# EAGLE design RPi_board_0.0.1 (EAGLE 7.2.0)
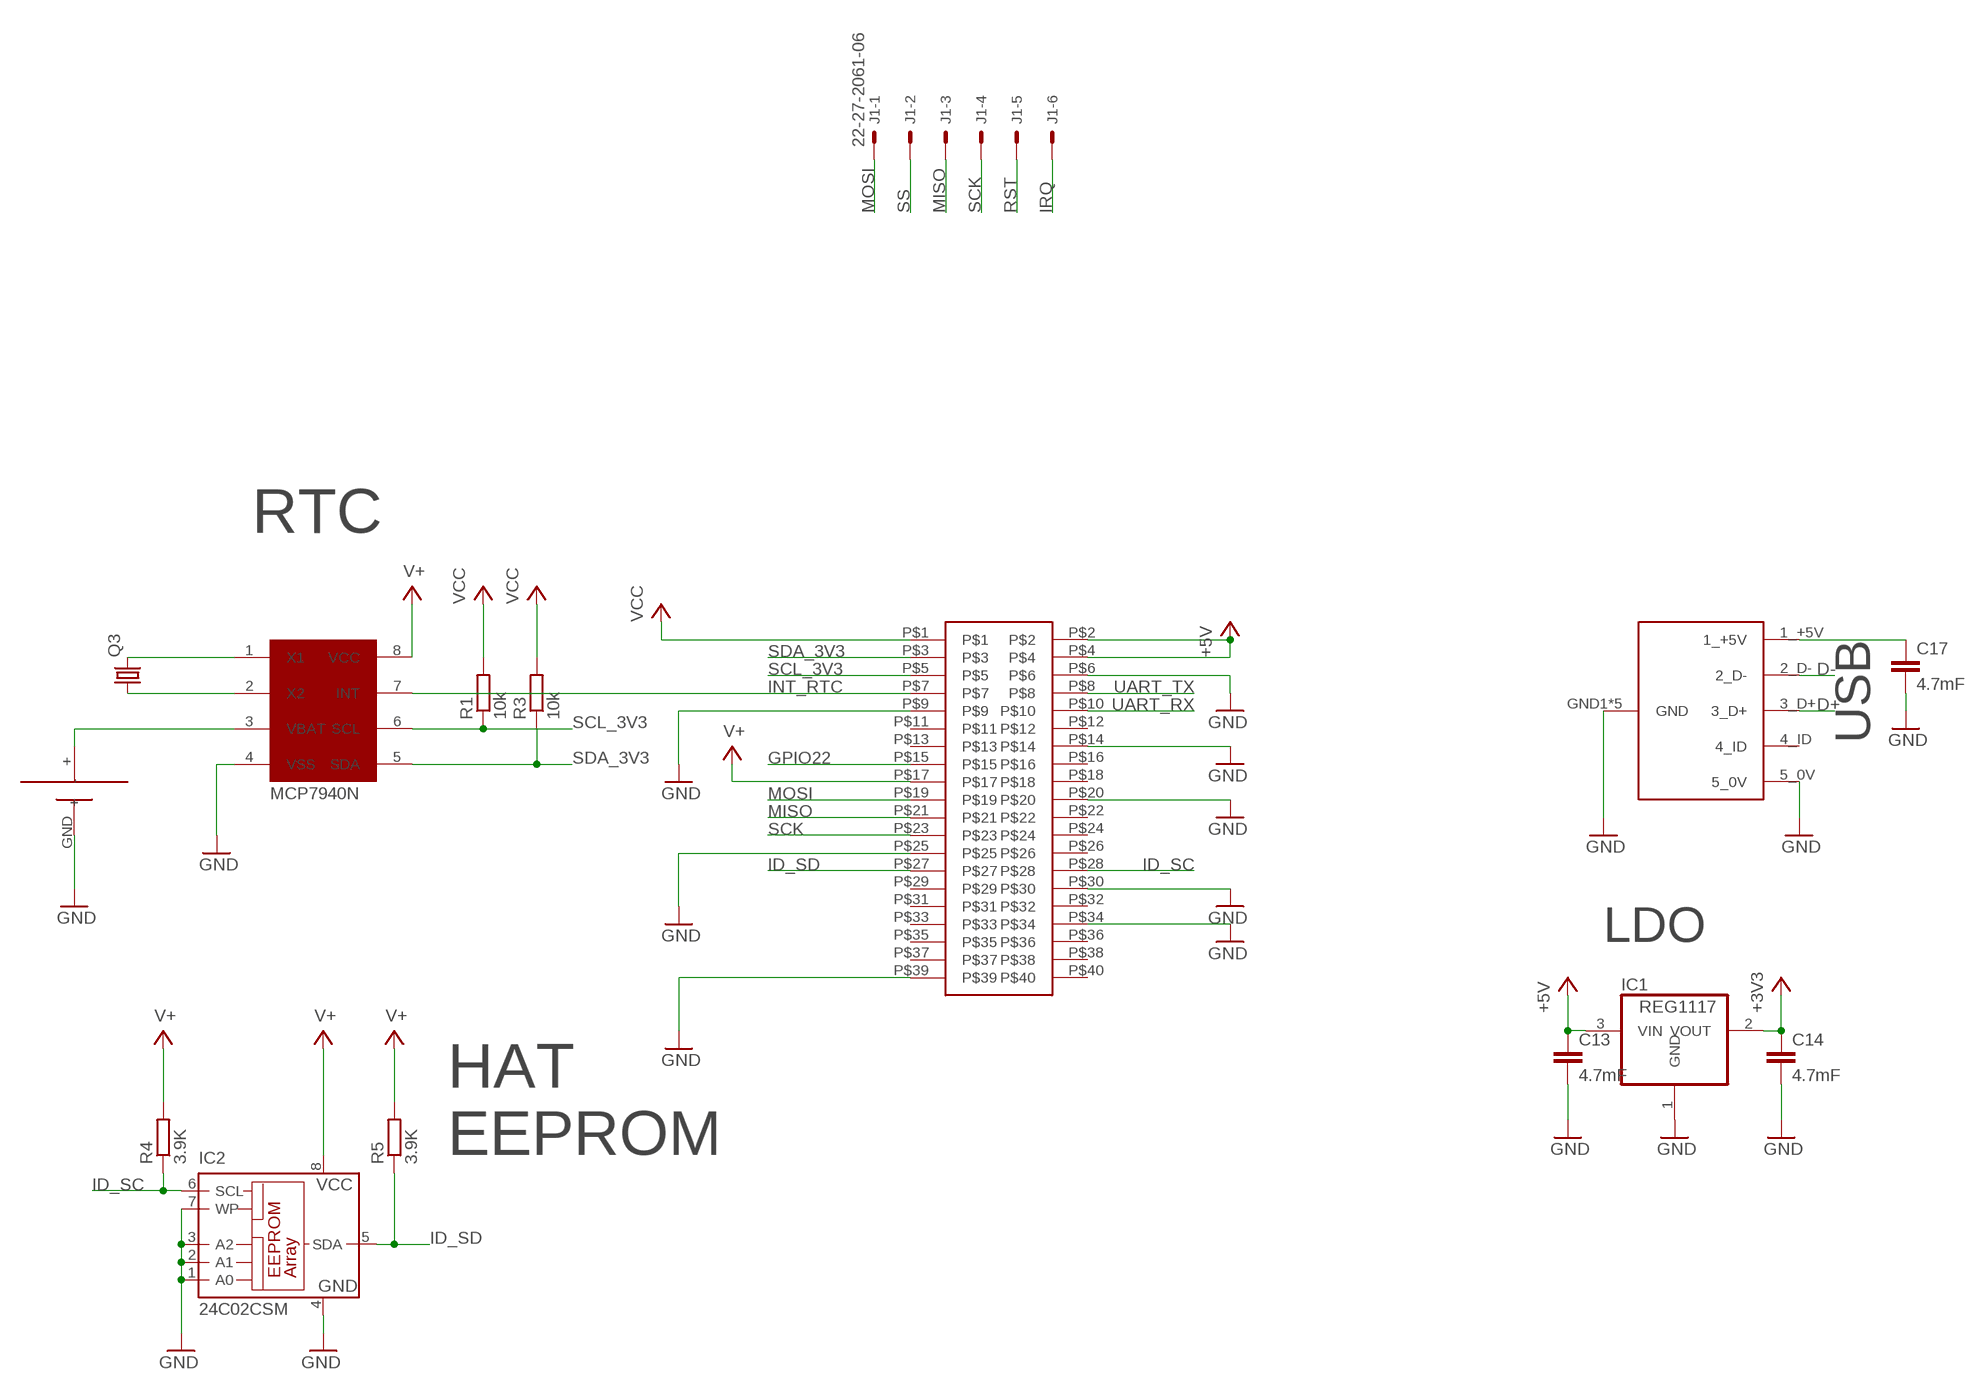
[diagram p0: schematic, sheet 1]

## Parts
C13  4.7mF  C-EUC0603  [C0603]
C14  4.7mF  C-EUC0603  [C0603]
C17  4.7mF  C-EUC0603  [C0603]
IC1  REG1117  [SOT223]
IC2  24C02CSM  [SO-08M]
J1  22-27-2061-06  [6410-06]
Q3  CRYSTALMM20SS  [MM20SS]
R1  10k  R-EU_R0603  [R0603]
R3  10k  R-EU_R0603  [R0603]
R4  3.9K  R-EU_R0603  [R0603]
R5  3.9K  R-EU_R0603  [R0603]
U$4  CR1216  [CR1216]
U$5  MCP7940N  [SO08]
U$9  MICRO_USB  [MICRO_USB]
U$11  HEADER  [20X2]

## Nets
+3V3: C14.1 IC1.2(VOUT)
+5V: C13.1 IC1.3(VIN) U$11.P$2 U$11.P$4
D+: U$9.3_D+
D-: U$9.2_D-
GND: C13.2 C14.2 C17.2 IC1.1(GND) IC2.1(A0) IC2.2(A1) IC2.3(A2) IC2.4(GND) IC2.7(WP) U$4.GND(-) U$5.4(VSS) U$9.5_0V U$9.GND1(GND) U$9.GND2(GND) U$9.GND5(GND) U$9.P$1(GND) U$9.P$7(GND) U$11.P$6 U$11.P$9 U$11.P$14 U$11.P$20 U$11.P$25 U$11.P$30 U$11.P$34 U$11.P$39
GPIO22: U$11.P$15
ID_SC: IC2.6(SCL) R4.1 U$11.P$28
ID_SD: IC2.5(SDA) R5.1 U$11.P$27
INT_RTC: U$5.7(INT) U$11.P$7
IRQ: J1.6
MISO: J1.3 U$11.P$21
MOSI: J1.1 U$11.P$19
N$1: Q3.1 U$5.2(X2)
N$2: Q3.4 U$5.1(X1)
N$17: C17.1 U$9.1_+5V
RST: J1.5
SCK: J1.4 U$11.P$23
SCL_3V3: R1.1 U$5.6(SCL) U$11.P$5
SDA_3V3: R3.1 U$5.5(SDA) U$11.P$3
SS: J1.2
UART_RX: U$11.P$10
UART_TX: U$11.P$8
V+: IC2.8(VCC) R4.2 R5.2 U$5.8(VCC) U$11.P$17
VBAT+: U$4.+ U$5.3(VBAT)
VCC: R1.2 R3.2 U$11.P$1
Unconnected: U$9.4_ID U$11.P$11 U$11.P$12 U$11.P$13 U$11.P$16 U$11.P$18 U$11.P$22 U$11.P$24 U$11.P$26 U$11.P$29 U$11.P$31 U$11.P$32 U$11.P$33 U$11.P$35 U$11.P$36 U$11.P$37 U$11.P$38 U$11.P$40

## Notes on the sheet
- RTC
- USB
- MCP7940N
- LDO
- HAT
  EEPROM

## Library data of the parts
C13 C14 C17 = rcl:C-EU: CAPACITOR, European symbol
IC1 = burr-brown:REG1117: 800mA and 1A Low Dropout (LDO) Positive Regulator 1.8V, 2.5V, 2.85V, 3.3V, 5V, and Adj; MPN: REG1117; OC_FARNELL: 1097566; OC_NEWARK: 14P6981
IC2 = microchip:24C*: Serial EEPROM 1 K/2 K/4 K; MF: MICROCHIP; MPN: 24C02C-I/SN; OC_FARNELL: 1084339; OC_NEWARK: 96K4063
J1 = con-molex:22-?-06: CONNECTOR wire to board 2.54 mm (.1 inch) pitch header; OC_FARNELL: unknown; OC_NEWARK: unknown
Q3 = crystal:CRYSTAL: CRYSTAL; OC_FARNELL: unknown; OC_NEWARK: unknown
R1 R3-R5 = rcl:R-EU_: RESISTOR, European symbol
U$4 = cr1216:CR1216
U$5 = MCP7940N:MCP7940N
U$9 = MICRO_USB:MICRO_USB
U$11 = 20x2_cirqoid:HEADER

## Board
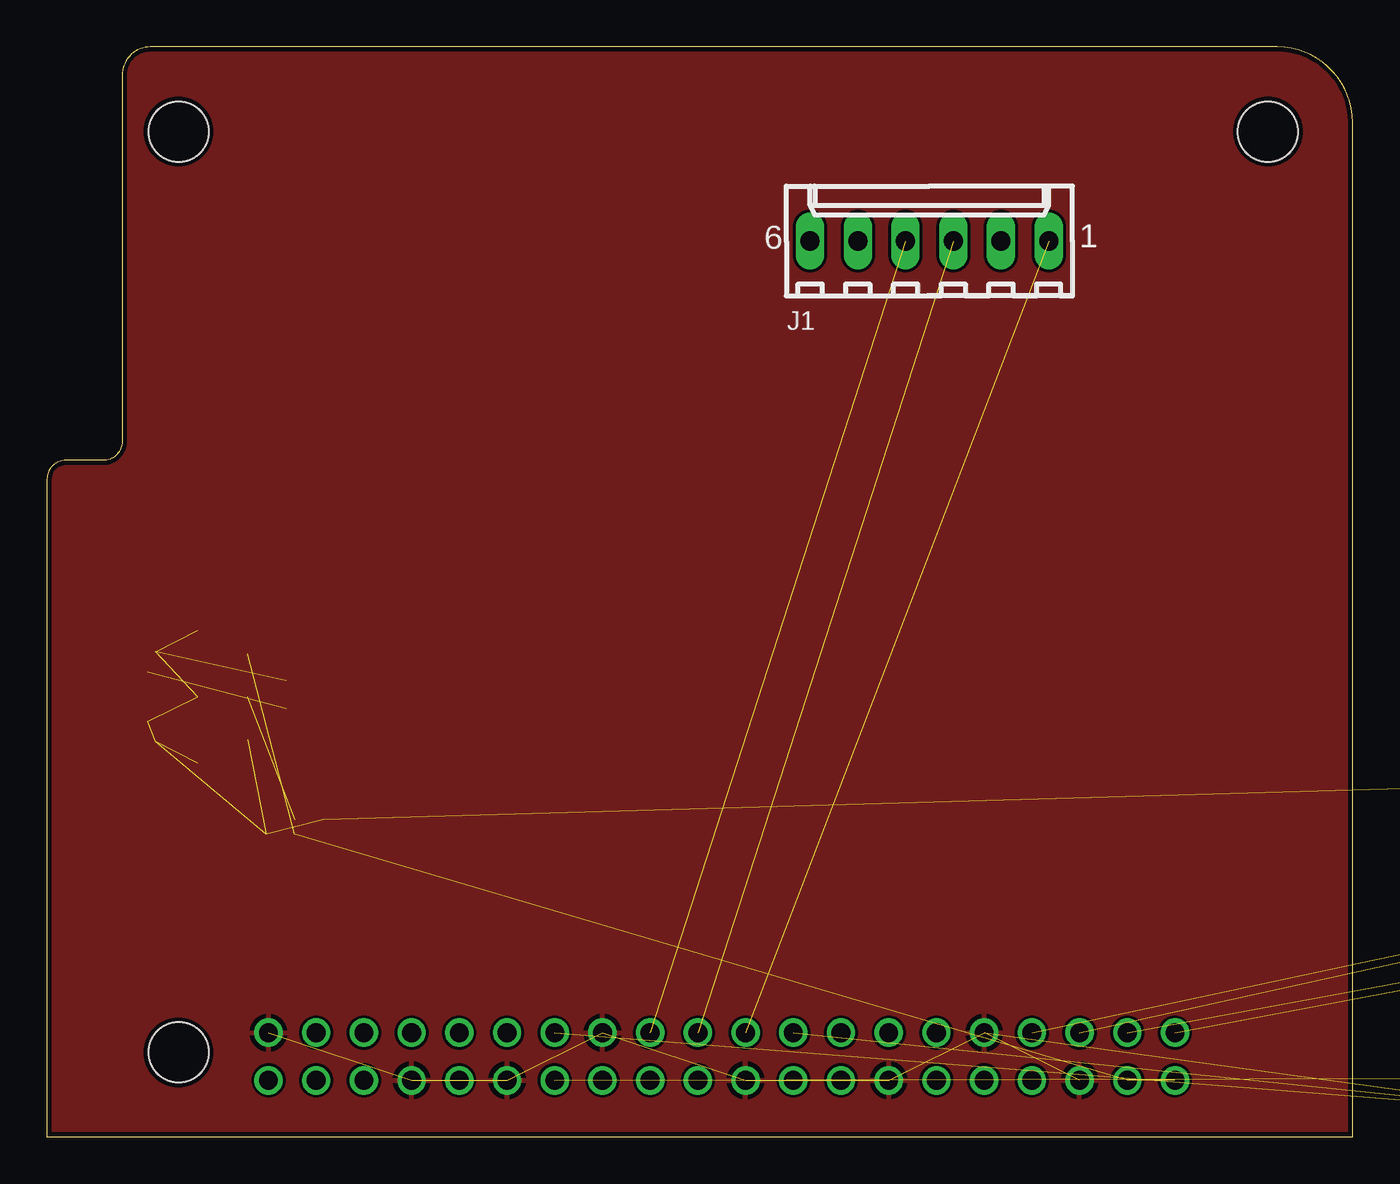
[diagram p1: board, top side]
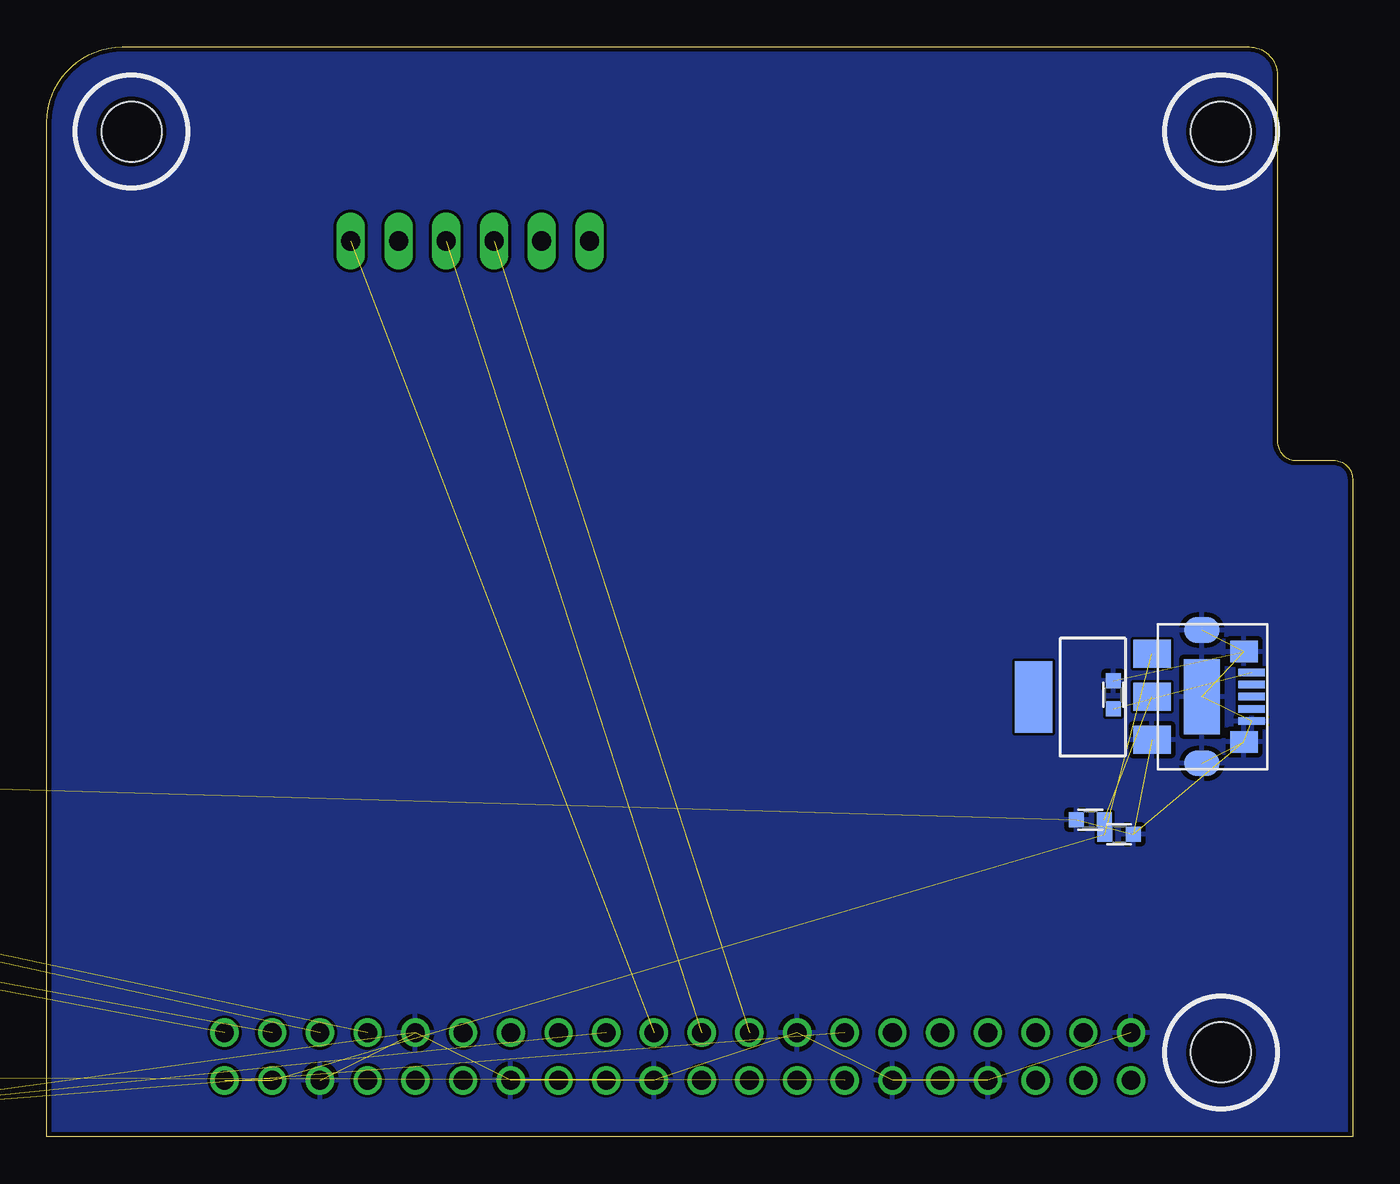
[diagram p2: board, bottom side, seen from below]

Size 69.5 x 58 mm. Coordinates in mm from the lower left corner, seen from the top.
Outline: 0,35 0,0 69.5,0 69.5,54 arc90 65.5,58 5.5,58 arc90 4,56.5 4,37 arc-90 3,36 1,36 arc90 0,35
Copper layers (1*16): Top 0.035mm / dielectric 1.5mm / Bottom 0.035mm
Design rules "SeeedStudio_2layer_DRU_no_angle_20140221": minimum track width 6mil, minimum drill 12mil, track to track 6mil, track to pad 6mil, pad to pad 6mil, via to via 6mil, smd to smd 0mil, copper to edge 10mil, drill to drill 10mil, minimum pad ring 10mil, minimum via ring 6mil, stop-mask expansion 2mil, vias tented up to drill 100mil, thermal gap 10mil
Holes 3.2 mm at 65,53.5 7,53.5 7,4.5

### Footprints (pad centres in the part's own frame; a part is rotated, then mirrored left to right if it is on the bottom)
C0603 = smd 0.8 x 0.8: 1 -0.75,0; 2 0.75,0
SOT223 = smd 1.499 x 2.007: 1 -2.261,-3.15; 2 0.025,-3.15; 3 2.311,-3.15 | smd 3.81 x 2.007: 4 0,3.15
SO-08M = smd 0.6 x 2.2: 1 -1.905,-3.33; 2 -0.635,-3.33; 3 0.635,-3.33; 4 1.905,-3.33; 5 1.905,3.33; 6 0.635,3.33; 7 -0.635,3.33; 8 -1.905,3.33
6410-06 = drill 1.016 long: 1 6.35,0; 2 3.81,0; 3 1.27,0; 4 -1.27,0; 5 -3.81,0; 6 -6.35,0
MM20SS = smd 1.27 x 1.88: 1 -2.794,-1.524; 2 2.794,-1.524; 3 2.794,1.524; 4 -2.794,1.524
R0603 = smd 1 x 1.1: 1 -0.85,0; 2 0.85,0
CR1216 = smd 2.5 x 5.1: + -7.65,0; P$2 7.65,0 | smd 10.2 x 10.2: GND 0,0
SO08 = smd 0.6 x 2.2: 1 -1.905,-2.6; 2 -0.635,-2.6; 3 0.635,-2.6; 4 1.905,-2.6; 5 1.905,2.6; 6 0.635,2.6; 7 -0.635,2.6; 8 -1.905,2.6
MICRO_USB = smd 0.4 x 1.4: 1_+5V -1.3,2.65; 2_D- -0.65,2.65; 3_D+ 0,2.65; 4_ID 0.65,2.65; 5_0V 1.3,2.65 | smd 4 x 1.9: GND1 0,0 | smd 1.35 x 1.9: GND2 -3.55,0; GND5 3.55,0 | smd 1.15 x 1.45: P$1 -2.4,2.25; P$7 2.4,2.25
20X2 = drill 1: P$1 0,0; P$2 0,2.54; P$3 2.54,0; P$4 2.54,2.54; P$5 5.08,0; P$6 5.08,2.54; P$7 7.62,0; P$8 7.62,2.54; P$9 10.16,0; P$10 10.16,2.54; P$11 12.7,0; P$12 12.7,2.54; P$13 15.24,0; P$14 15.24,2.54; P$15 17.78,0; P$16 17.78,2.54; P$17 20.32,0; P$18 20.32,2.54; P$19 22.86,0; P$20 22.86,2.54; P$21 25.4,0; P$22 25.4,2.54; P$23 27.94,0; P$24 27.94,2.54; P$25 30.48,0; P$26 30.48,2.54; P$27 33.02,0; P$28 33.02,2.54; P$29 35.56,0; P$30 35.56,2.54; P$31 38.1,0; P$32 38.1,2.54; P$33 40.64,0; P$34 40.64,2.54; P$35 43.18,0; P$36 43.18,2.54; P$37 45.72,0; P$38 45.72,2.54; P$39 48.26,0; P$40 48.26,2.54

### Placement (x,y rotation side)
C13  12.43,16.1 0 bottom
C14  13.95,16.88 180 bottom
C17  12.72,23.52 90 bottom
IC1  13.82,23.4 90 bottom
IC2  79.33,2.95 270 bottom  (outside the outline)
J1  46.98,47.67 0 top
Q3  87.75,15.73 0 bottom  (outside the outline)
R1  88.45,16.43 180 bottom  (outside the outline)
R3  96,12.5 180 bottom  (outside the outline)
R4  87.85,3.15 0 bottom  (outside the outline)
R5  88.05,0.65 0 bottom  (outside the outline)
U$4  95.35,24.25 90 bottom  (outside the outline)
U$5  92.67,16.57 180 bottom  (outside the outline)
U$9  8.03,23.43 270 bottom
U$11  60.05,5.55 180 top

### Tracks (layer width: path | path; a pad name or v marks a point on that pad's centre or on a via)
+3V3  (1 unrouted)
+5V  (3 unrouted)
GND  (24 unrouted)
  pour Bottom (rank 6): 0,35 0,0 69.5,0 69.5,54 arc90 65.5,58 5.5,58 arc90 4,56.5 4,37.02 arc-90 2.98,36 1,36 arc90
  pour Top (rank 6): 0,35 0,0 69.5,0 69.5,54 arc90 65.5,58 5.5,58 arc90 4,56.5 4,37 arc-90 3,36 1,36 arc90
ID_SC  (2 unrouted)
ID_SD  (2 unrouted)
INT_RTC  (1 unrouted)
MISO  (1 unrouted)
MOSI  (1 unrouted)
N$1  (1 unrouted)
N$2  (1 unrouted)
N$17  (1 unrouted)
SCK  (1 unrouted)
SCL_3V3  (2 unrouted)
SDA_3V3  (2 unrouted)
V+  (4 unrouted)
VBAT+  (1 unrouted)
VCC  (2 unrouted)